# EAGLE schematic whaleSch (EAGLE 8.4.1)
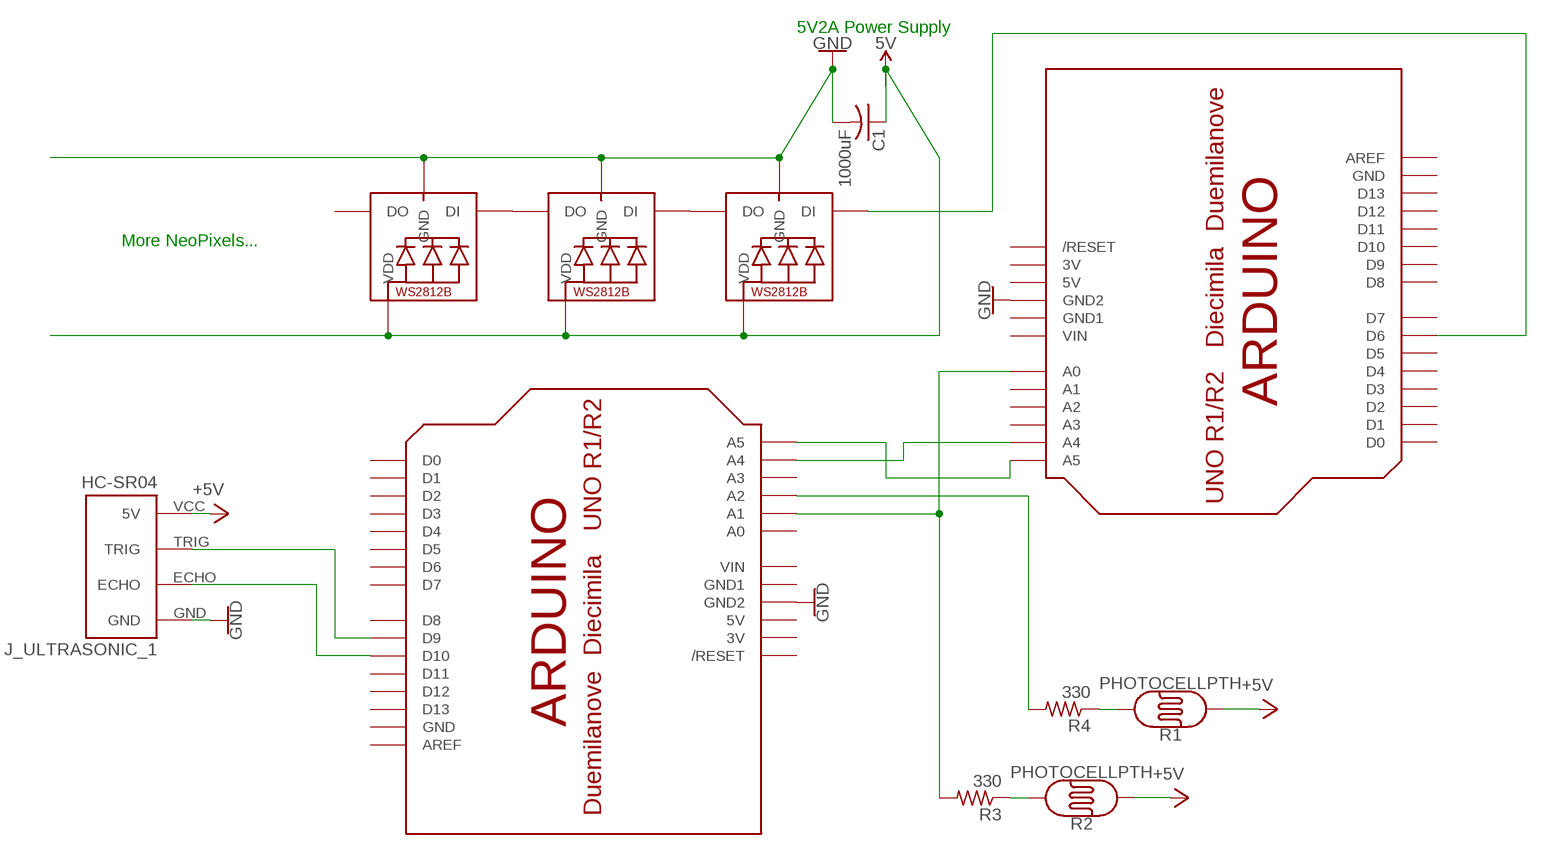
[diagram p0: schematic, sheet 1]

## Parts
C1  1000uF  C-US025-024X044  [C025-024X044]
J_ULTRASONIC_1  HC-SR04  [HC-SR04_FOOTPRINT]
LED1  WS2812B3535  [LED3535]
LED3  WS2812B3535  [LED3535]
LED4  WS2812B3535  [LED3535]
R1  PHOTOCELLPTH  [PHOTOCELL]
R2  PHOTOCELLPTH  [PHOTOCELL]
R3  330  FLIPFLOP-RES  [0805-THM]
R4  330  FLIPFLOP-RES  [0805-THM]
U$1  ARDUINOUNO  [ARDUINO]
U$2  ARDUINOUNO  [ARDUINO]

## Nets
5V: C1.1 LED1.2(VDD) LED3.2(VDD) LED4.2(VDD)
+5V: J_ULTRASONIC_1.VCC(5V) R1.1 R2.1
GND: C1.2 J_ULTRASONIC_1.GND LED1.4(GND) LED3.4(GND) LED4.4(GND) U$1.GND2 U$2.GND2
N$1: U$1.A4 U$2.A4
N$2: U$1.A5 U$2.A5
N$3: LED1.3(DO) LED3.1(DI)
N$4: LED3.3(DO) LED4.1(DI)
N$5: LED1.1(DI) U$2.D6
N$6: R2.2 R3.1
N$7: R1.2 R4.1
N$8: R3.2 U$1.A1 U$2.A0
N$9: R4.2 U$1.A2
N$10: J_ULTRASONIC_1.ECHO U$1.D10
N$11: J_ULTRASONIC_1.TRIG U$1.D9
Unconnected: LED4.3(DO) U$1.A0 U$1.A3 U$1.AREF U$1.D0 U$1.D1 U$1.D2 U$1.D3 U$1.D4 U$1.D5 U$1.D6 U$1.D7 U$1.D8 U$1.D11 U$1.D12 U$1.D13 U$1.RESET(/RESET) U$2.A1 U$2.A2 U$2.A3 U$2.AREF U$2.D0 U$2.D1 U$2.D2 U$2.D3 U$2.D4 U$2.D5 U$2.D7 U$2.D8 U$2.D9 U$2.D10 U$2.D11 U$2.D12 U$2.D13 U$2.RESET(/RESET)

## Notes on the sheet
- 5V2A Power Supply
- More NeoPixels...

## Power pins joined to a net without a drawn wire
3V: U$1.3V U$2.3V
5V: U$1.5V U$2.5V
GND: U$1.GND U$2.GND
GND1: U$1.GND1 U$2.GND1
VIN: U$1.VIN U$2.VIN

## Library data of the parts
C1 = adafruit:C-US: CAPACITOR, American symbol
J_ULTRASONIC_1 = Ultrasonic Sensor HC-SR04:HC-SR04: Ultrasonic Sensor HC-SR04
LED1 LED3 LED4 = adafruit:WS2812B
R1 R2 = SparkFun-Sensors:PHOTOCELL: Photocell (Photodetector, Photo Resistor, CdS) This is a very small light sensor. A photocell changes (also called a photodetector, photo resistor, CdS or photoconductive cell) resistance depending on the amount of light it is exposed to. These little sensors make great ambient light triggers (when light in the room turns on, do something). Datasheet <http://cdn.sparkfun.com/datasheets/Sensors/LightImaging/SEN-09088.pdf> SparkFun Products Mini Photocell <https://www.sparkfun.com/products/9088> (SEN-09088); PROD_ID: COMP-09129; SF_ID: SEN-09088
R3 R4 = adafruit:FLIPFLOP-RES: Flip Flop resistor An 0805 resistor inside a standard 1/4W 5% resistor. Makes for easy mods
U$1 U$2 = adafruit:ARDUINO: Arduino Diecimila/Duemilanove Make a shield with ease, this package has all the named pins as well as the two mounting drill holes and an outline of the USB and DC power connector. The outline is on the DIMENSION layer, so if your board house uses it they will cut the outline to match. http://www.ladyada.net/library/pcb/eaglelibrary.html